# Altium schematic sheet FPGA_config.SchDoc: FPGA configuration
size A4; Author: L. Sartory; Organization: L. Sartory; Address2: Nixie clock; Address3: with GPS synchronization; DocumentNumber: 5; Revision: B1; SheetNumber: 5; SheetTotal: 12
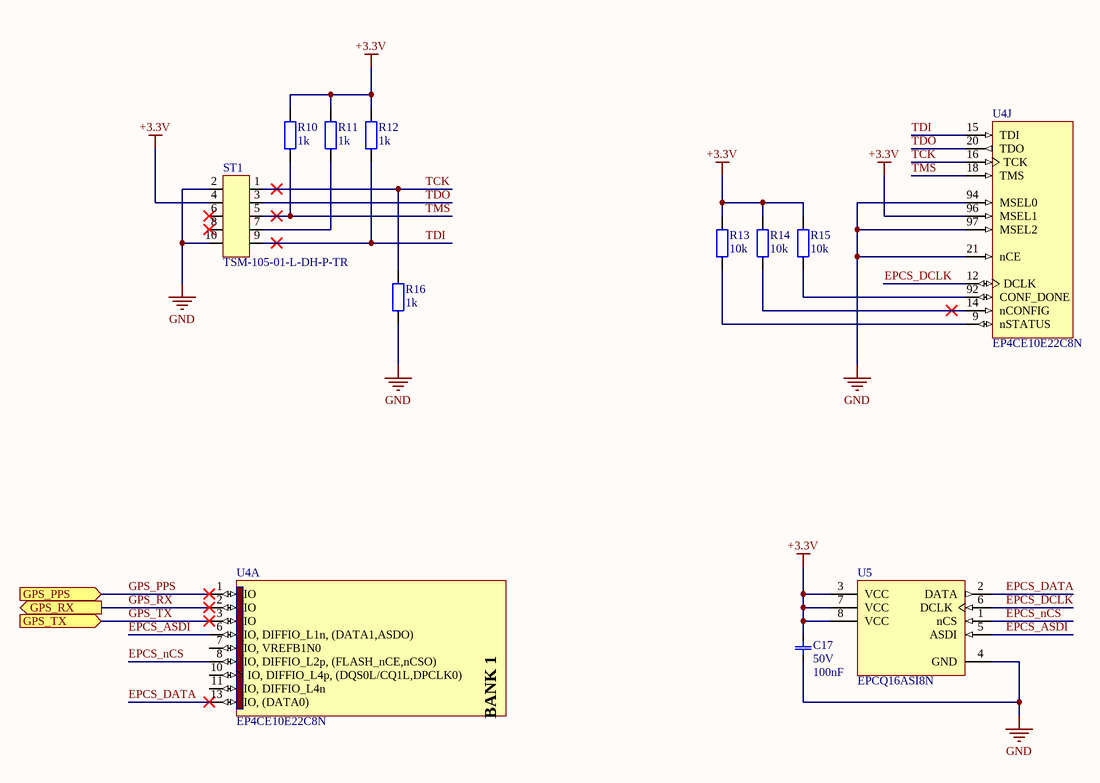
[diagram p0: FPGA_config.SchDoc]

## Parts
C17  Voltage: 50V  [MLCC_0603]  (hidden comment: 100nF)
R10  1k  [RES0805]
R11  1k  [RES0805]
R12  1k  [RES0805]
R13  10k  [RES0805]
R14  10k  [RES0805]
R15  10k  [RES0805]
R16  1k  [RES0805]
ST1  TSM-105-01-L-DH-P-TR  [TSM-105-01-L-DH-P-TR]
U4  EP4CE10E22C8N  [EP4CE10E22C8N]  (parts A,J of 13)
U5  EPCQ16ASI8N  [EPCQ16ASI8N]

## Ports
GPS_PPS (in), GPS_RX (out), GPS_TX (in)

## Nets
+3.3V: C17.2 R10.2 R11.2 R12.2 R13.2 R14.2 R15.2 ST1.4 U4.96(MSEL1) U5.3(VCC) U5.7(VCC) U5.8(VCC)
GND: C17.1 R16.1 ST1.2 ST1.10 U4.21(nCE) U4.94(MSEL0) U4.97(MSEL2) U5.4(GND)
EPCS_ASDI: U4.6(IO,_DIFFIO_L1n,_(DATA1,ASDO)) U5.5(ASDI)
EPCS_DATA: U4.13(IO,_(DATA0)) U5.2(DATA)
EPCS_DCLK: U4.12(DCLK) U5.6(DCLK)
EPCS_nCS: U4.8(IO,_DIFFIO_L2p,_(FLASH_nCE,nCSO)) U5.1(nCS)
GPS_PPS: U4.1(IO) ; port GPS_PPS
GPS_RX: U4.2(IO) ; port GPS_RX
GPS_TX: U4.3(IO) ; port GPS_TX
TCK: R16.2 ST1.1 U4.16(TCK)
TDI: R12.1 ST1.9 U4.15(TDI)
TDO: ST1.3 U4.20(TDO)
TMS: R10.1 ST1.5 U4.18(TMS)
NetR11_1: R11.1 ST1.7
NetR13_1: R13.1 U4.9(nSTATUS)
NetR14_1: R14.1 U4.14(nCONFIG)
NetR15_1: R15.1 U4.92(CONF_DONE)

Not connected (* = marked no-connect by the designer): ST1 6* 8*; U4 7(IO,_VREFB1N0) 10(IO,_DIFFIO_L4p,_(DQS0L/CQ1L,DPCLK0)) 11(IO,_DIFFIO_L4n)

## Notes on the sheet
- Title
- Size:
- Date:
- A4
- Number:
- Time:
- Revision:
- Sheet
- of
- File:
- (in symbol 1k 0805) Text
- (in symbol 10k 0805) Text
- (in symbol EP4CE10E22C8N, part A) BANK 1

## Library data of the parts
C17 = MLCC 100nF 50V 0603: Value: 100nF
R10-R12 R16 = 1k 0805: Chip resistor 1k 0805; Value: 1k
R13-R15 = 10k 0805: Chip resistor 10k 0805; Value: 10k
ST1 = TSM-105-01-L-DH-P-TR: Male Connector, 2x5 pins, 2.54 mm, right angle; Angle: 90; Columns: 2; Contacts: 10; Mounting_Technology: SMD; Pitch: 2,54mm; Rated_Current: 4,7A; Rated_Voltage: 475V; Rows: 5; Subtype: Header; Temperature_Max: -55°C; Temperature_Min: 125°C; AccessRights: 2147483647; ContentType: Component; Folder: 02_Component_Classes\01_Connectors\; ItemHRID: CON-00013; RevisionId: A2; Gender: Male; Height: 6,1mm; Part_Number: TSM-105-01-L-DH-P; RoHS: Yes; A2000_Part_Number: 06.02.0061; ComponentType: Connector; ContentTypeGUID: CB3C11C4-E317-11DF-B822-12313F0024A2; FolderGUID: 5495AD52-6690-435F-9E49-44D2F6351017; ItemGUID: 027ABF0C-CE72-4FE2-A6FC-FEB3307CCD0E; LifeCycle: In Prototype; LifeCycleStateGUID: F6472DB9-40C4-4028-BB05-F9D9E28A4AB8; ReleaseDate: 29/03/2017 03:00:55 PM
U4 = EP4CE10E22C8N: Cyclone IV Family FPGA, 1.2V Core, 91 I/O Pins, 2 PLLs, 144-Pin QFP, Speed Grade 8, Commercial Grade, Pb-Free; Manufacturer: Altera; PackageDescription: 144-Pin Plastic Enhanced Quad Flat Pack (EQFP) - Wire Bond - A:1.65 - D2:5.4; ComponentLink2Description: Handbook; DatasheetVersion: ver1.6, Nov-2011; ComponentLink2URL: http://www.altera.com/literature/hb/cyclone-iv/cyclone4-handbook.pdf; PackageVersion: ver1.0, Jan-2011; ComponentLink1URL: http://www.altera.com/; ComponentLink3Description: Pinout; ComponentLink4Description: Package Specification; PackageReference: EQFP144_A-165_D2-54; Code_JEDEC: MS-026-BFB-HD; ComponentLink3URL: http://www.altera.com/literature/lit-dp.jsp?category=cyc%204&showspreadsheet=y; ComponentLink1Description: Manufacturer URL; ComponentLink4URL: http://www.altera.com/devicepackaging/04R00402-00.pdf
U5 = EPCQ16ASI8N: EPCS16 Series, In-system programmable 3.3V serial configuration device, 8-Pin SOIC, 16-Megabit, Industrial Grade, Pb-Free; Configures: All Arria series, all Cyclone series and all Stratix series (except Stratix); Code_JEDEC: MS-012-AA; PackageVersion: ver14.2, Oct-2005; PackageReference: SOIC8; Code_IPC: SOIC127P600-8; PackageDescription: 8-Pin Small Outline Integrated Circuit Package (SOIC8); DatasheetVersion: ver3.0, Dec-2009